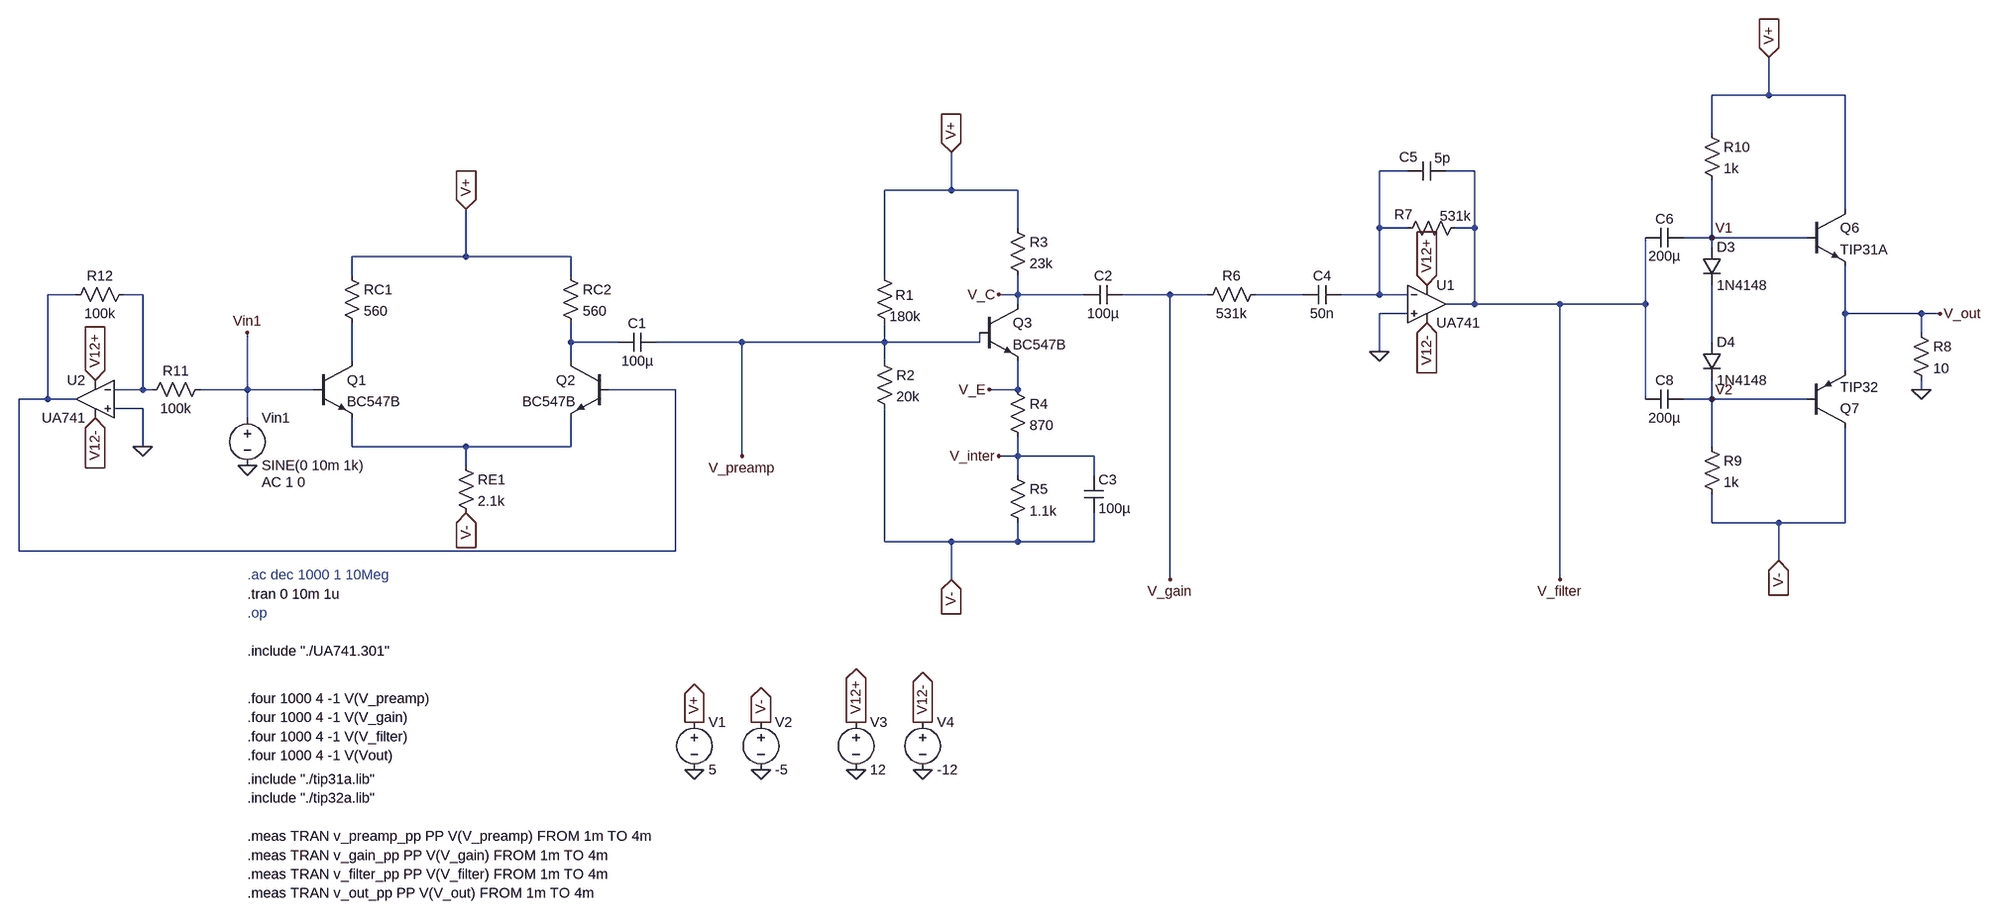
[diagram p0: schematic Audio_Amplifier_Design.asc]
Audio_Amplifier_Design.asc, the LTspice schematic file:
Version 4
SHEET 1 3704 1024
WIRE 2384 -336 2384 -400
WIRE 2384 -336 2288 -336
WIRE 2512 -336 2384 -336
WIRE 2288 -272 2288 -336
WIRE 1728 -208 1680 -208
WIRE 1840 -208 1792 -208
WIRE 960 -176 960 -240
WIRE 960 -176 848 -176
WIRE 1072 -176 960 -176
WIRE 2512 -144 2512 -336
WIRE 1072 -112 1072 -176
WIRE 1680 -112 1680 -208
WIRE 1728 -112 1680 -112
WIRE 1840 -112 1840 -208
WIRE 1840 -112 1808 -112
WIRE 2288 -96 2288 -192
WIRE 2288 -96 2240 -96
WIRE 2448 -96 2288 -96
WIRE 2288 -80 2288 -96
WIRE 144 -64 144 -144
WIRE 144 -64 -48 -64
WIRE 320 -64 144 -64
WIRE -48 -32 -48 -64
WIRE 320 -32 320 -64
WIRE 848 -32 848 -176
WIRE -512 0 -560 0
WIRE -400 0 -432 0
WIRE 1072 0 1072 -32
WIRE 1072 0 1040 0
WIRE 1184 0 1072 0
WIRE 1328 0 1248 0
WIRE 1392 0 1328 0
WIRE 1552 0 1472 0
WIRE 1680 0 1680 -112
WIRE 1680 0 1616 0
WIRE 1728 0 1680 0
WIRE 1072 16 1072 0
WIRE 1840 16 1840 -112
WIRE 1840 16 1792 16
WIRE 1984 16 1840 16
WIRE 2176 16 2176 -96
WIRE 2176 16 1984 16
WIRE 1728 32 1680 32
WIRE 2512 32 2512 -48
WIRE 2640 32 2512 32
WIRE 2672 32 2640 32
WIRE 2640 64 2640 32
WIRE 320 80 320 48
WIRE 400 80 320 80
WIRE 608 80 464 80
WIRE 848 80 848 48
WIRE 848 80 608 80
WIRE 1008 80 1008 64
WIRE 1008 80 848 80
WIRE 2288 80 2288 -16
WIRE 1680 96 1680 32
WIRE -48 112 -48 48
WIRE 320 112 320 80
WIRE 848 112 848 80
WIRE 2512 128 2512 32
WIRE -400 160 -400 0
WIRE -400 160 -448 160
WIRE -384 160 -400 160
WIRE -224 160 -224 64
WIRE -224 160 -304 160
WIRE -112 160 -224 160
WIRE 496 160 384 160
WIRE 1072 160 1072 112
WIRE 1072 160 1024 160
WIRE 2640 160 2640 144
WIRE -560 176 -560 0
WIRE -560 176 -608 176
WIRE -512 176 -560 176
WIRE 2176 176 2176 16
WIRE 2288 176 2288 144
WIRE 2288 176 2240 176
WIRE 2448 176 2288 176
WIRE -400 192 -448 192
WIRE -224 208 -224 160
WIRE -400 256 -400 192
WIRE -48 256 -48 208
WIRE 144 256 -48 256
WIRE 320 256 320 208
WIRE 320 256 144 256
WIRE 2288 256 2288 176
WIRE 608 272 608 80
WIRE 1072 272 1072 240
WIRE 1072 272 1040 272
WIRE 1200 272 1072 272
WIRE 144 288 144 256
WIRE 1072 304 1072 272
WIRE 1200 304 1200 272
WIRE 2288 384 2288 336
WIRE 2400 384 2288 384
WIRE 2512 384 2512 224
WIRE 2512 384 2400 384
WIRE 848 416 848 192
WIRE 960 416 848 416
WIRE 1072 416 1072 384
WIRE 1072 416 960 416
WIRE 1200 416 1200 368
WIRE 1200 416 1072 416
WIRE -608 432 -608 176
WIRE 496 432 496 160
WIRE 496 432 -608 432
WIRE 2400 448 2400 384
WIRE 960 480 960 416
WIRE 1328 480 1328 0
WIRE 1984 480 1984 16
FLAG 528 800 0
FLAG 640 800 0
FLAG 528 720 V+
IOPIN 528 720 Out
FLAG 640 720 V-
IOPIN 640 720 Out
FLAG 144 -144 V+
IOPIN 144 -144 In
FLAG 144 368 V-
IOPIN 144 368 In
FLAG -224 288 0
FLAG 1040 0 V_C
FLAG 1024 160 V_E
FLAG 1040 272 V_inter
FLAG 960 -240 V+
IOPIN 960 -240 In
FLAG 960 480 V-
IOPIN 960 480 In
FLAG 1680 96 0
FLAG 1760 -16 V12+
IOPIN 1760 -16 In
FLAG 1760 48 V12-
IOPIN 1760 48 In
FLAG 800 800 0
FLAG 912 800 0
FLAG 800 720 V12+
IOPIN 800 720 Out
FLAG 912 720 V12-
IOPIN 912 720 Out
FLAG 1328 480 V_gain
FLAG 2640 160 0
FLAG 2672 32 V_out
FLAG 2288 -96 V1
FLAG 2288 176 V2
FLAG 2384 -400 V+
IOPIN 2384 -400 In
FLAG 2400 448 V-
IOPIN 2400 448 In
FLAG -480 144 V12+
IOPIN -480 144 In
FLAG -480 208 V12-
IOPIN -480 208 In
FLAG -400 256 0
FLAG 608 272 V_preamp
FLAG 1984 480 V_filter
FLAG -224 64 Vin1
SYMBOL npn -112 112 R0
SYMATTR InstName Q1
SYMATTR Value BC547B
SYMBOL npn 384 112 M0
SYMATTR InstName Q2
SYMATTR Value BC547B
SYMBOL res -64 -48 R0
SYMATTR InstName RC1
SYMATTR Value 560
SYMBOL res 304 -48 R0
SYMATTR InstName RC2
SYMATTR Value 560
SYMBOL res 128 272 R0
SYMATTR InstName RE1
SYMATTR Value 2.1k
SYMBOL voltage -224 192 R0
WINDOW 123 24 124 Left 2
WINDOW 39 0 0 Left 0
SYMATTR Value2 AC 1 0
SYMATTR InstName Vin1
SYMATTR Value SINE(0 10m 1k)
SYMBOL voltage 528 704 R0
WINDOW 123 0 0 Left 0
WINDOW 39 0 0 Left 0
SYMATTR InstName V1
SYMATTR Value 5
SYMBOL voltage 640 704 R0
WINDOW 123 0 0 Left 0
WINDOW 39 0 0 Left 0
SYMATTR InstName V2
SYMATTR Value -5
SYMBOL cap 464 64 R90
WINDOW 0 0 32 VBottom 2
WINDOW 3 32 32 VTop 2
SYMATTR InstName C1
SYMATTR Value 100µ
SYMBOL res 832 -48 R0
WINDOW 0 34 49 Left 2
WINDOW 3 24 85 Left 2
SYMATTR InstName R1
SYMATTR Value 180k
SYMBOL res 832 96 R0
SYMATTR InstName R2
SYMATTR Value 20k
SYMBOL res 1056 -128 R0
SYMATTR InstName R3
SYMATTR Value 23k
SYMBOL res 1056 144 R0
SYMATTR InstName R4
SYMATTR Value 870
SYMBOL res 1056 288 R0
SYMATTR InstName R5
SYMATTR Value 1.1k
SYMBOL npn 1008 16 R0
SYMATTR InstName Q3
SYMATTR Value BC547B
SYMBOL cap 1248 -16 R90
WINDOW 0 0 32 VBottom 2
WINDOW 3 32 32 VTop 2
SYMATTR InstName C2
SYMATTR Value 100µ
SYMBOL cap 1184 304 R0
SYMATTR InstName C3
SYMATTR Value 100µ
SYMBOL OpAmps\\opamp2 1760 -48 R0
SYMATTR InstName U1
SYMATTR Value UA741
SYMBOL res 1488 -16 R90
WINDOW 0 0 56 VBottom 2
WINDOW 3 32 56 VTop 2
SYMATTR InstName R6
SYMATTR Value 531k
SYMBOL cap 1616 -16 R90
WINDOW 0 0 32 VBottom 2
WINDOW 3 32 32 VTop 2
SYMATTR InstName C4
SYMATTR Value 50n
SYMBOL res 1824 -128 R90
WINDOW 0 9 103 VBottom 2
WINDOW 3 -20 16 VTop 2
SYMATTR InstName R7
SYMATTR Value 531k
SYMBOL cap 1792 -224 R90
WINDOW 0 8 63 VBottom 2
WINDOW 3 -21 6 VTop 2
SYMATTR InstName C5
SYMATTR Value 5p
SYMBOL voltage 800 704 R0
WINDOW 123 0 0 Left 0
WINDOW 39 0 0 Left 0
SYMATTR InstName V3
SYMATTR Value 12
SYMBOL voltage 912 704 R0
WINDOW 123 0 0 Left 0
WINDOW 39 0 0 Left 0
SYMATTR InstName V4
SYMATTR Value -12
SYMBOL npn 2448 -144 R0
SYMATTR InstName Q6
SYMATTR Value TIP31A
SYMBOL res 2624 48 R0
SYMATTR InstName R8
SYMATTR Value 10
SYMBOL pnp 2448 224 M180
SYMATTR InstName Q7
SYMATTR Value TIP32
SYMBOL diode 2272 -80 R0
SYMATTR InstName D3
SYMATTR Value 1N4148
SYMBOL diode 2272 80 R0
SYMATTR InstName D4
SYMATTR Value 1N4148
SYMBOL res 2272 240 R0
SYMATTR InstName R9
SYMATTR Value 1k
SYMBOL res 2272 -288 R0
SYMATTR InstName R10
SYMATTR Value 1k
SYMBOL cap 2240 -112 R90
WINDOW 0 0 32 VBottom 2
WINDOW 3 32 32 VTop 2
SYMATTR InstName C6
SYMATTR Value 200µ
SYMBOL cap 2240 160 R90
WINDOW 0 0 32 VBottom 2
WINDOW 3 32 32 VTop 2
SYMATTR InstName C8
SYMATTR Value 200µ
SYMBOL OpAmps\\opamp2 -480 112 M0
SYMATTR InstName U2
SYMATTR Value UA741
SYMBOL res -288 144 R90
WINDOW 0 0 56 VBottom 2
WINDOW 3 32 56 VTop 2
SYMATTR InstName R11
SYMATTR Value 100k
SYMBOL res -416 -16 R90
WINDOW 0 0 56 VBottom 2
WINDOW 3 32 56 VTop 2
SYMATTR InstName R12
SYMATTR Value 100k
TEXT -224 472 Left 2 ;.ac dec 1000 1 10Meg
TEXT -224 504 Left 2 !.tran 0 10m 1u
TEXT -224 536 Left 2 ;.op
TEXT -224 776 Left 2 !.four 1000 4 -1 V(Vout)
TEXT -224 600 Left 2 !.include "./UA741.301"
TEXT -224 712 Left 2 !.four 1000 4 -1 V(V_gain)
TEXT -224 680 Left 2 !.four 1000 4 -1 V(V_preamp)
TEXT -224 744 Left 2 !.four 1000 4 -1 V(V_filter)
TEXT -224 816 Left 2 !.include "./tip31a.lib"
TEXT -224 848 Left 2 !.include "./tip32a.lib"
TEXT -224 912 Left 2 !.meas TRAN v_preamp_pp PP V(V_preamp) FROM 1m TO 4m
TEXT -224 944 Left 2 !.meas TRAN v_gain_pp PP V(V_gain) FROM 1m TO 4m
TEXT -224 976 Left 2 !.meas TRAN v_filter_pp PP V(V_filter) FROM 1m TO 4m
TEXT -224 1008 Left 2 !.meas TRAN v_out_pp PP V(V_out) FROM 1m TO 4m

The netlist it stands for:
* Audio_Amplifier_Design.asc
Q1 N007 Vin1 N008 0 BC547B
Q2 N005 N002 N008 0 BC547B
RC1 V+ N007 560
RC2 V+ N005 560
RE1 N008 V- 2.1k
Vin1 Vin1 0 SINE(0 10m 1k) AC 1 0
V1 V+ 0 5
V2 V- 0 -5
C1 V_preamp N005 100µ
R1 V+ V_preamp 180k
R2 V_preamp V- 20k
R3 V+ V_C 23k
R4 V_E V_inter 870
R5 V_inter V- 1.1k
Q3 V_C V_preamp V_E 0 BC547B
C2 V_gain V_C 100µ
C3 V_inter V- 100µ
XU1 0 N001 V12+ V12- V_filter UA741  ; pins In+ In- V+ V- OUT
R6 N004 V_gain 531k
C4 N001 N004 50n
R7 V_filter N001 531k
C5 V_filter N001 5p
V3 V12+ 0 12
V4 V12- 0 -12
Q6 V+ V1 V_out 0 TIP31A
R8 V_out 0 10
Q7 V- V2 V_out 0 TIP32
D3 V1 N006 1N4148
D4 N006 V2 1N4148
R9 V2 V- 1k
R10 V+ V1 1k
C6 V1 V_filter 200µ
C8 V2 V_filter 200µ
XU2 0 N003 V12+ V12- N002 UA741  ; pins In+ In- V+ V- OUT
R11 Vin1 N003 100k
R12 N003 N002 100k
.model D D
.lib standard.dio
.model NPN NPN
.model PNP PNP
.lib standard.bjt
* .ac dec 1000 1 10Meg
.tran 0 10m 1u
* .op
.four 1000 4 -1 V(Vout)
.include "./UA741.301"
.four 1000 4 -1 V(V_gain)
.four 1000 4 -1 V(V_preamp)
.four 1000 4 -1 V(V_filter)
.include "./tip31a.lib"
.include "./tip32a.lib"
.meas TRAN v_preamp_pp PP V(V_preamp) FROM 1m TO 4m
.meas TRAN v_gain_pp PP V(V_gain) FROM 1m TO 4m
.meas TRAN v_filter_pp PP V(V_filter) FROM 1m TO 4m
.meas TRAN v_out_pp PP V(V_out) FROM 1m TO 4m
.backanno
.end